# EAGLE design 20210418-JGaylord-V2153M_DSheet (EAGLE 9.6.2)
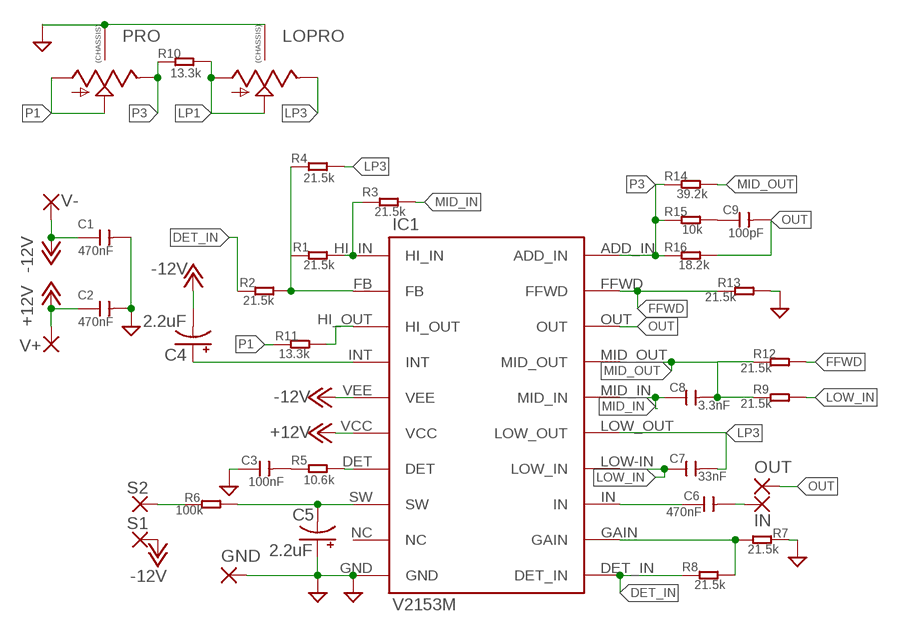
[diagram p0: schematic, sheet 1]

## Parts
C1  470nF  CERAMIC-100NF-50V-10%-X7R(0805)  [C0805]
C2  470nF  CERAMIC-100NF-50V-10%-X7R(0805)  [C0805]
C3  100nF  CERAMIC-100NF-50V-10%-X7R(0805)  [C0805]
C4  2.2uF  C-POL-US_TANTALUM-1206(3216-METRIC)  [CAPMP3216X180N]
C5  2.2uF  C-POL-US_TANTALUM-1206(3216-METRIC)  [CAPMP3216X180N]
C6  470nF  CERAMIC-100NF-50V-10%-X7R(0805)  [C0805]
C7  33nF  CERAMIC-100NF-50V-10%-X7R(0805)  [C0805]
C8  3.3nF  CERAMIC-100NF-50V-10%-X7R(0805)  [C0805]
C9  100pF  CERAMIC-100NF-50V-10%-X7R(0805)  [C0805]
GND  WIREPAD1,6/0,9  [1,6/0,9]
IC1  V2153M  [V2153M]
IN  WIREPAD1,6/0,9  [1,6/0,9]
LOPRO  9MM_SNAP-IN_POT_CHASSIS  [9MM_SNAP-IN_POT]
OUT  WIREPAD1,6/0,9  [1,6/0,9]
PRO  9MM_SNAP-IN_POT_CHASSIS  [9MM_SNAP-IN_POT]
R1  21.5k  SMD-RES-2.2K-5%-1/8W(0805)  [R0805]
R2  21.5k  SMD-RES-2.2K-5%-1/8W(0805)  [R0805]
R3  21.5k  SMD-RES-2.2K-5%-1/8W(0805)  [R0805]
R4  21.5k  SMD-RES-2.2K-5%-1/8W(0805)  [R0805]
R5  10.6k  SMD-RES-2.2K-5%-1/8W(0805)  [R0805]
R6  100k  SMD-RES-2.2K-5%-1/8W(0805)  [R0805]
R7  21.5k  SMD-RES-2.2K-5%-1/8W(0805)  [R0805]
R8  21.5k  SMD-RES-2.2K-5%-1/8W(0805)  [R0805]
R9  21.5k  SMD-RES-2.2K-5%-1/8W(0805)  [R0805]
R10  13.3k  SMD-RES-2.2K-5%-1/8W(0805)  [R0805]
R11  13.3k  SMD-RES-2.2K-5%-1/8W(0805)  [R0805]
R12  21.5k  SMD-RES-2.2K-5%-1/8W(0805)  [R0805]
R13  21.5k  SMD-RES-2.2K-5%-1/8W(0805)  [R0805]
R14  39.2k  SMD-RES-2.2K-5%-1/8W(0805)  [R0805]
R15  10k  SMD-RES-2.2K-5%-1/8W(0805)  [R0805]
R16  18.2k  SMD-RES-2.2K-5%-1/8W(0805)  [R0805]
S1  WIREPAD1,6/0,9  [1,6/0,9]
S2  WIREPAD1,6/0,9  [1,6/0,9]
V+  WIREPAD1,6/0,9  [1,6/0,9]
V-  WIREPAD1,6/0,9  [1,6/0,9]

## Nets
+12V: C2.1 IC1.VCC V+.1(P)
-12V: C1.1 C4.2(-) IC1.VEE S1.1(P) V-.1(P)
DET_IN: IC1.DET_IN R2.1 R8.1
FFWD: IC1.FFWD R12.2 R13.1
GND: C1.2 C2.2 C3.1 C5.1(+) GND.1(P) IC1.GND LOPRO.CHASSIS1 LOPRO.CHASSIS2 PRO.CHASSIS1 PRO.CHASSIS2 R7.2 R13.2
IN: C6.2 IN.1(P)
LOW_IN: C7.1 IC1.LOW-IN(LOW_IN) R9.2
LP1: LOPRO.1(A) LOPRO.2(S) R10.2
LP3: C7.2 IC1.LOW_OUT LOPRO.3(E) R4.2
MID_IN: C8.1 IC1.MID_IN R3.2
MID_OUT: C8.2 IC1.MID_OUT R9.1 R12.1 R14.2
N$1: C4.1(+) IC1.INT
N$2: IC1.FB R1.1 R2.2 R4.1
N$3: IC1.GAIN R7.1 R8.2
N$4: IC1.HI_IN R1.2 R3.1
N$5: C3.2 R5.1
N$6: IC1.DET R5.2
N$7: C5.2(-) IC1.SW R6.2
N$8: C6.1 IC1.IN
N$9: R6.1 S2.1(P)
N$10: C9.1 R15.2
N$11: IC1.HI_OUT R11.2
OUT: C9.2 IC1.OUT OUT.1(P) R16.2
P1: PRO.1(A) PRO.2(S) R11.1
P3: IC1.ADD_IN PRO.3(E) R10.1 R14.1 R15.1 R16.1
Unconnected: IC1.NC

## Library data of the parts
C1-C3 C6-C9 = OPL_Capacitor:CERAMIC-100NF-50V-10%-X7R(0805): 302010165; MPN: CC0805KRX7R9BB104; VALUE: 100nf
C4 C5 = Capacitor:C-POL-US: Capacitor Polarised - ANSI; CATEGORY: Capacitor
GND IN OUT S1 S2 V+ V- = wirepad:WIREPAD: Wire PAD connect wire on PCB
IC1 = SOIC127P790X160-20N:V2153M
LOPRO PRO = MusicThingModular:9MM_SNAP-IN_POT_CHASSIS: 9mm vertical snap-in pot, Alpha / Panasonic style, with a connection to the metal chassis for grounding
R1-R16 = OPL_Resistor:SMD-RES-2.2K-5%-1/8W(0805): 301012193; MPN: RC0805JR-072K2L; VALUE: 2.2K

## Board
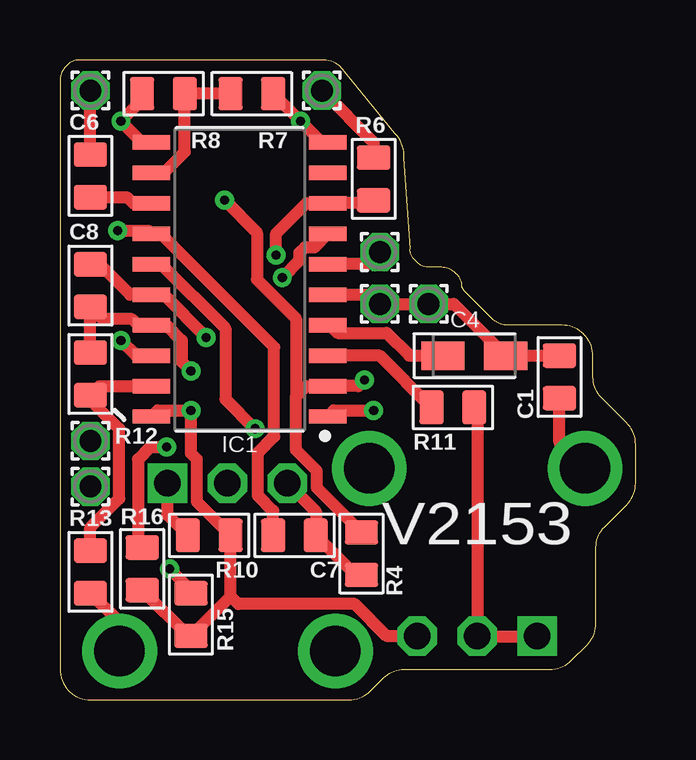
[diagram p1: board, top side]
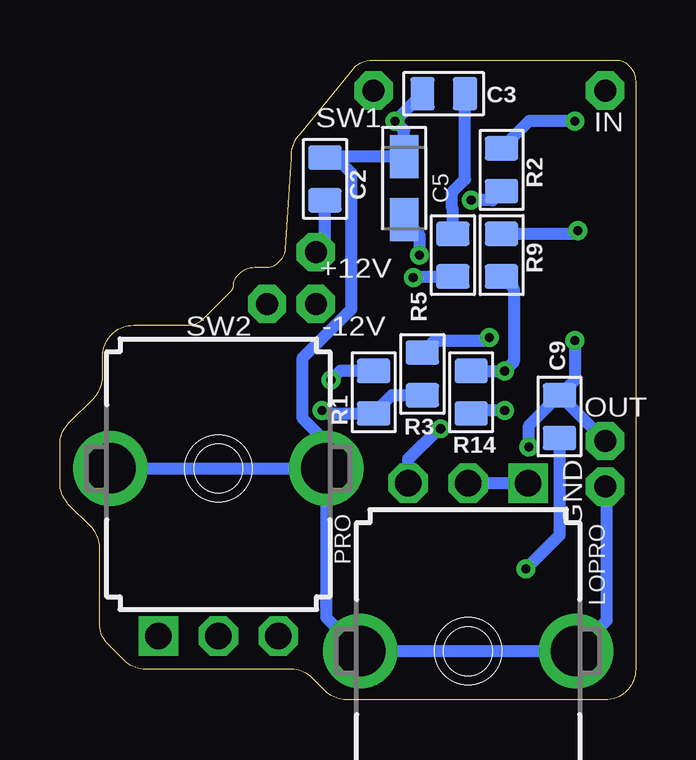
[diagram p2: board, bottom side, seen from below]

Size 24 x 26.68 mm. Coordinates in mm from the lower left corner, seen from the top.
Outline: 0,25.8 0,1.27 arc90 1.27,0 12.05,0 arc45 12.95,0.37 13.48,0.91 arc-45 14.35,1.27 20.43,1.27 arc45 21.33,1.64 21.98,2.29 arc45 22.35,3.19 22.35,6.35 arc-45 22.71,7.22 23.63,8.14 arc45 24,9.04 24,10.65 arc45 23.63,11.55 22.58,12.6 arc-45 22.23,13.46 22.23,14.33 arc45 21.85,15.23 21.84,15.25 arc45 20.94,15.62 18.67,15.62 arc-45 18.02,15.89 16.85,17.05 arc-45 16.76,17.27 arc45 16.58,17.71 16.51,17.78 arc45 15.9,18.03 15.37,18.03 arc-45 14.93,18.21 14.72,18.42 arc-45 14.61,18.81 14.35,22.59 arc45 13.98,23.61 11.68,26.43 arc45 10.78,26.67 0.76,26.67 arc45 0.33,26.49 0.25,26.42 arc45 0,25.8
Copper layers (1*16): Top 0.035mm / dielectric 1.5mm / Bottom 0.035mm
Design rules "default *": minimum track width 6mil, minimum drill 0.35mm, track to track 6mil, track to pad 6mil, pad to pad 6mil, via to via 6mil, smd to smd 6mil, copper to edge 15mil, drill to drill 6mil, minimum pad ring 10mil, minimum via ring 8mil, stop-mask expansion 4mil, vias tented up to drill 0mil, thermal gap 10mil

### Footprints (pad centres in the part's own frame; a part is rotated, then mirrored left to right if it is on the bottom)
C0805 = smd 1.397 x 1.016: 1 0,0.889; 2 0,-0.889
CAPMP3216X180N = smd 1.796 x 1.189: 1 -1.31,0; 2 1.31,0
1,6/0,9 = drill 0.914 pad 1.6 octagon: 1 0,0
V2153M = smd 1.565 x 0.598: ADD_IN 3.673,5.715; DET -3.673,-1.905; DET_IN 3.673,-5.715; FB -3.673,4.445; FFWD 3.673,4.445; GAIN 3.673,-4.445; GND -3.673,-5.715; HI_IN -3.673,5.715; HI_OUT -3.673,3.175; IN 3.673,-3.175; INT -3.673,1.905; LOW-IN 3.673,-1.905; LOW_OUT 3.673,-0.635; MID_IN 3.673,0.635; MID_OUT 3.673,1.905; NC -3.673,-4.445; OUT 3.673,3.175; SW -3.673,-3.175; VCC -3.673,-0.635; VEE -3.673,0.635
9MM_SNAP-IN_POT = drill 1.1 square: 1 -2.5,-7 | drill 1.1 octagon: 2 0,-7; 3 2.5,-7 | drill 2.1 pad 2.794: CHASSIS1 -4.5,0; CHASSIS2 4.5,0
R0805 = smd 1.397 x 1.016: 1 0,0.889; 2 0,-0.889

### Placement (x,y rotation side)
C1  20.83,13.46 0 top
C2  12.95,21.72 180 bottom
C3  8,25.27 90 bottom
C4  17.27,14.35 0 top
C5  9.65,21.34 270 bottom
C6  1.27,21.84 180 top
C7  9.78,6.86 90 top
C8  1.27,17.27 0 top
C9  3.17,11.81 180 bottom
GND  1.27,8.89 0 top
IC1  7.49,17.53 180 top
IN  1.27,25.4 0 top
LOPRO  6.99,2.03 180 bottom
OUT  1.27,10.79 0 top
PRO  17.4,9.65 0 bottom
R1  10.92,12.83 0 bottom
R2  5.59,22.1 0 bottom
R3  8.89,13.59 180 bottom
R4  12.57,6.1 0 top
R5  7.62,18.54 0 bottom
R6  13.08,21.72 0 top
R7  8,25.27 90 top
R8  4.32,25.27 90 top
R9  5.59,18.54 180 bottom
R10  6.22,6.86 270 top
R11  16.38,12.19 270 top
R12  1.27,13.59 0 top
R13  1.27,5.33 0 top
R14  6.86,12.83 180 bottom
R15  5.46,3.56 180 top
R16  3.43,5.46 180 top
S1  15.37,16.51 0 top
S2  10.92,25.4 0 top
V+  13.34,18.67 0 top
V-  13.34,16.51 0 top

### Tracks (layer width: path | path; a pad name or v marks a point on that pad's centre or on a via)
+12V
  Top 0.508: V+.1 12.83,18.16 IC1.VCC
  Bottom 0.508: V+.1 12.95,19.05 C2.1
-12V
  Top 0.508: IC1.VEE 12.95,16.89 V-.1 S1.1 16.42,16.51 C4.2 C1.1
DET_IN  (via drill 0.38)
  Top 0.508: R8.1 3.43,25.02 v2.54,24.13 3.43,23.24 IC1.DET_IN
  Bottom 0.508: v2.54,24.13 4.45,24.13 R2.1
FFWD
  Top 0.508: IC1.FFWD 1.65,13.08 R12.2 1.27,12.5 2.48,11.29 2.48,8.39 1.27,7.18 R13.1
GND  (via drill 0.38)
  Top 0.508: R13.2 2.48,3.23 LOPRO.CHASSIS1 | PRO.CHASSIS1 20.83,10.72 C1.2 | R7.2 v10.03,24.13 10.92,23.24 IC1.GND
  Bottom 0.508: GND.1 1.22,8.84 1.22,3.3 LOPRO.CHASSIS1 LOPRO.CHASSIS2 12.9,3.45 PRO.CHASSIS2 | 12.53,22.65 C5.1 9.65,23.75 v10.03,24.13 R7.2 | 12.53,22.65 12.91,22.65 C2.2 | PRO.CHASSIS1 PRO.CHASSIS2 | PRO.CHASSIS2 12.9,10.75 13.88,11.73 13.88,14.26 11.85,16.29 11.85,21.96 12.53,22.65
IN
  Top 0.508: C6.2 IN.1
LOW_IN  (via drill 0.38)
  Top 0.508: v2.41,19.56 3.69,19.56 IC1.LOW-IN 4.21,19.43 8.93,14.71 8.93,10.97 8.25,10.3 8.25,8.52 8.89,7.89 C7.1
  Bottom 0.508: R9.2 2.54,19.43 v2.41,19.56
LP1
  Top 0.508: R10.2 4.49,7.71 LOPRO.1
  Bottom 0.508: LOPRO.1 LOPRO.2
LP3  (via drill 0.38)
  Top 0.508: IC1.LOW_OUT 4.21,18.16 6.9,15.47 6.9,12.54 v8.13,11.3 | LOPRO.3 10.67,7.85 C7.2 12.32,5.21 R4.2
  Bottom 0.508: v8.13,11.3 8.23,11.3 9.48,10.05 LOPRO.3
MID_IN  (via drill 0.38)
  Top 0.508: C8.1 1.65,18.16 2.92,16.89 IC1.MID_IN 4.32,16.89 v6.1,15.11
  Bottom 0.508: v6.1,15.11 6.22,14.99 8.38,14.99 R3.2
MID_OUT  (via drill 0.38)
  Top 0.508: R12.1 C8.2 1.78,15.88 3,15.88 3.26,15.62 IC1.MID_OUT 4.45,15.62 5.08,14.99 5.08,14.1 v5.46,13.72
  Bottom 0.508: R14.2 v5.46,13.72 5.08,14.1 5.08,17.14 R9.1
N$1
  Top 0.508: IC1.INT 11.25,15.62 11.56,15.3 13.61,15.3 14.56,14.35 C4.1
N$2  (via drill 0.38)
  Top 0.508: v12.7,13.34 12.45,13.08 IC1.FB 10.27,13.08 9.84,12.64 | 9.84,12.64 9.84,15.91 8.22,17.52 8.22,19.47 v6.86,20.83 | R4.1 10.72,8.84 10.72,9.54 9.84,10.42 9.84,12.64
  Bottom 0.508: R1.1 12.32,13.72 v12.7,13.34 | R2.2 5.97,20.83 v6.86,20.83
N$3
  Top 0.508: R7.1 R8.2 5.21,22.84 4.33,21.97 IC1.GAIN
N$4  (via drill 0.38)
  Top 0.508: IC1.HI_IN 11.42,12.06 v13.08,12.06
  Bottom 0.508: v13.08,12.06 12.95,11.94 R1.2 10.16,12.7 R3.1
N$5
  Bottom 0.508: C3.2 7.11,21.71 7.66,21.16 7.66,20.5 7.62,20.46 R5.1
N$6  (via drill 0.38)
  Top 0.508: IC1.DET 10.6,18.87 10.21,18.87 9.98,18.63 9.98,18.31 v9.27,17.6
  Bottom 0.508: v9.27,17.6 9.22,17.65 R5.2
N$7  (via drill 0.38)
  Top 0.508: R6.2 12.95,20.7 IC1.SW 10.27,20.7 9.02,19.45 v9.02,18.54
  Bottom 0.508: C5.2 9.02,19.39 v9.02,18.54
N$8
  Top 0.508: IC1.IN 3.05,20.7 2.8,20.95 C6.1
N$9
  Top 0.508: S2.1 13.08,23.24 R6.1
N$10  (via drill 0.38)
  Top 0.508: R15.2 5.46,4.57 v4.57,5.46
  Bottom 0.508: C9.1 3.17,6.86 v4.57,5.46
N$11
  Top 0.508: R11.2 13.34,14.35 IC1.HI_OUT
OUT  (via drill 0.38)
  Top 0.508: IC1.OUT 3.17,14.35 v2.54,14.99 | R16.2 3.25,6.53 3.25,10.03 3.77,10.54 v4.45,10.54
  Bottom 0.508: OUT.1 C9.2 | C9.2 2.54,13.34 v2.54,14.99 | v4.45,10.54 4.45,11.43 C9.2
P1
  Top 0.508: PRO.1 PRO.2 17.4,12.06 R11.1
P3  (via drill 0.38)
  Top 0.508: IC1.ADD_IN 4.07,12.06 v5.46,12.06 5.46,10.28 5.72,10.03 5.72,8.25 R10.1 7.11,4.32 | 7.11,4.32 R15.1 5.33,2.67 R16.1 | PRO.3 13.64,2.65 12.3,4 7.43,4 7.11,4.32
  Bottom 0.508: v5.46,12.06 6.73,12.06 R14.1

### Text on the board
tPlace: V2153
bPlace: IN | SW1 | +12V | -12V | SW2 | OUT | GND